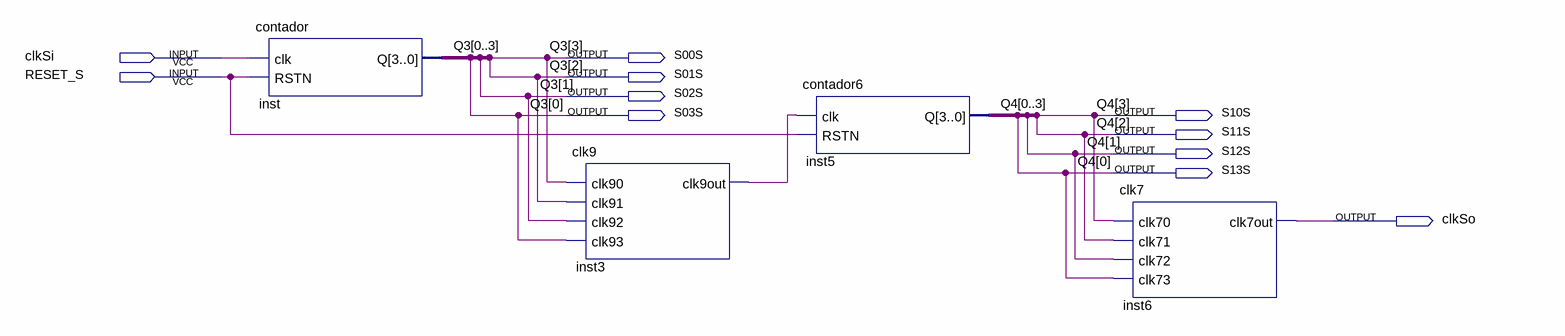
[diagram p0: schematic sheet]
// Quartus schematic contS.bdf as structural Verilog: 4 symbols, 11 pins
module contS (
  input  clkSi,
  input  RESET_S,
  output S00S,
  output S01S,
  output S02S,
  output S03S,
  output S10S,
  output S11S,
  output S12S,
  output S13S,
  output clkSo
);

  wire inst3_clk9out;

  contador inst (.clk(clkSi), .RSTN(RESET_S), .Q({S03S, S02S, S01S, S00S}));
  clk9 inst3 (.clk90(S00S), .clk91(S01S), .clk92(S02S), .clk93(S03S), .clk9out(inst3_clk9out));
  contador6 inst5 (.clk(inst3_clk9out), .RSTN(RESET_S), .Q({S13S, S12S, S11S, S10S}));
  clk7 inst6 (.clk70(S10S), .clk71(S11S), .clk72(S12S), .clk73(S13S), .clk7out(clkSo));

  // Other names for the same wires on the sheet: Q3[3:0] = {S00S, S01S, S02S, S03S};
  //   Q4[3:0] = {S10S, S11S, S12S, S13S}
endmodule
